# EAGLE schematic UNDP_Sensor (EAGLE 9.6.2)
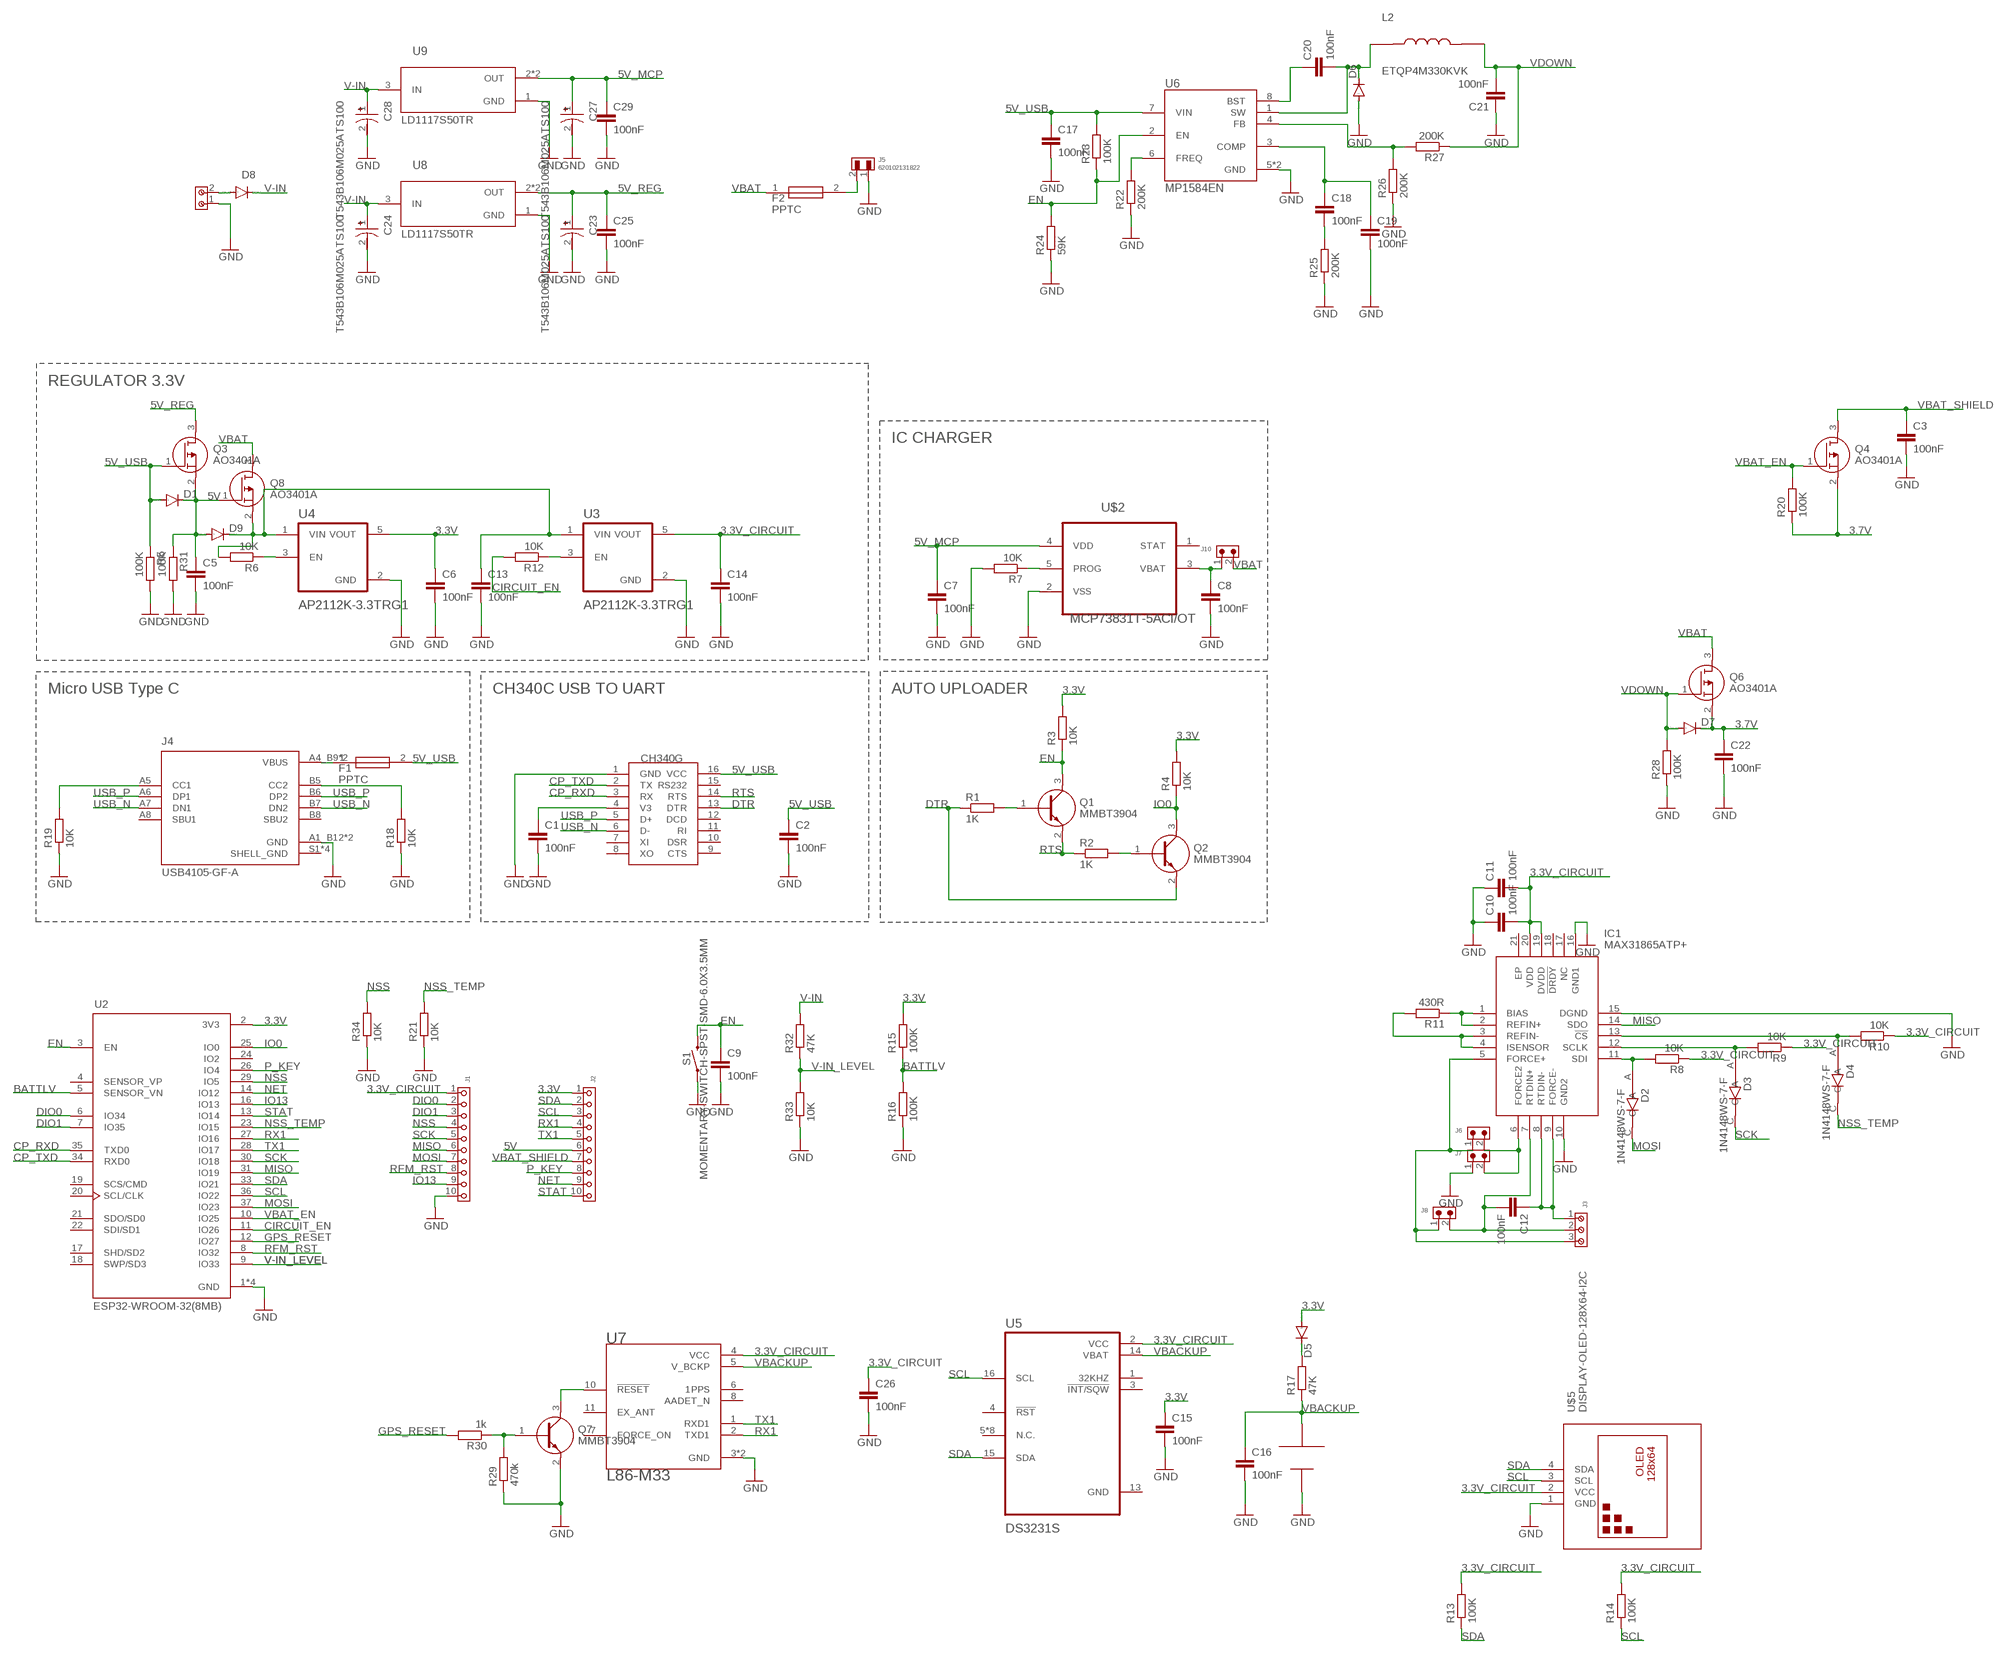
[diagram p0: schematic, sheet 1]

## Parts
C1  100nF  C-EUC0603  [C0603]
C2  100nF  C-EUC0603  [C0603]
C3  100nF  C-EUC0603  [C0603]
C5  100nF  C-EUC0603  [C0603]
C6  100nF  C-EUC0603  [C0603]
C7  100nF  C-EUC0603  [C0603]
C8  100nF  C-EUC0603  [C0603]
C9  100nF  C-EUC0603  [C0603]
C10  100nF  C-EUC0603  [C0603]
C11  100nF  C-EUC0603  [C0603]
C12  100nF  C-EUC0603  [C0603]
C13  100nF  C-EUC0603  [C0603]
C14  100nF  C-EUC0603  [C0603]
C15  100nF  C-EUC0603  [C0603]
C16  100nF  C-EUC0603  [C0603]
C17  100nF  C-EUC0603  [C0603]
C18  100nF  C-EUC0603  [C0603]
C19  100nF  C-EUC0603  [C0603]
C20  100nF  C-EUC0603  [C0603]
C21  100nF  C-EUC0603  [C0603]
C22  100nF  C-EUC0603  [C0603]
C23  T543B106M025ATS100  [CAPPM3528X210N]
C24  T543B106M025ATS100  [CAPPM3528X210N]
C25  100nF  C-EUC0603  [C0603]
C26  100nF  C-EUC0603  [C0603]
C27  T543B106M025ATS100  [CAPPM3528X210N]
C28  T543B106M025ATS100  [CAPPM3528X210N]
C29  100nF  C-EUC0603  [C0603]
D1  DIODE-DO214AC  [DO214AC]
D2  1N4148WS-7-F  [SOD2513X120N]
D3  1N4148WS-7-F  [SOD2513X120N]
D4  1N4148WS-7-F  [SOD2513X120N]
D5  DIODE-DO214AC  [DO214AC]
D6  DIODE-DO214AC  [DO214AC]
D7  DIODE-DO214AC  [DO214AC]
D8  DIODE-DO214AC  [DO214AC]
D9  DIODE-DO214AC  [DO214AC]
F1  PPTC  MF-NSML260_12-2  [FUSC3216X100N]
F2  PPTC  MF-NSML260_12-2  [FUSC3216X100N]
IC1  MAX31865ATP+  [QFN65P500X500X80-21N]
J1  6200XX11821_62001011821  [62001011821]
J2  6200XX11821_62001011821  [62001011821]
J3  691134710003  [691134710003]
J4  USB4105-GF-A  [GCT_USB4105-GF-A]
J5  620102131822  [620102131822]
J6  6130XX11121_61300211121  [61300211121]
J7  6130XX11121_61300211121  [61300211121]
J8  6130XX11121_61300211121  [61300211121]
J10  6130XX11121_61300211121  [61300211121]
J11  691134710002  [691134710002]
L2  ETQP4M330KVK  [IND_ETQP4M330KVK]
Q1  MMBT3904  [SOT95P240X120-3N]
Q2  MMBT3904  [SOT95P240X120-3N]
Q3  AO3401A  [SOT95P280X125-3N]
Q4  AO3401A  [SOT95P280X125-3N]
Q6  AO3401A  [SOT95P280X125-3N]
Q7  MMBT3904  [SOT95P240X120-3N]
Q8  AO3401A  [SOT95P280X125-3N]
R1  1K  R-EU_R0603  [R0603]
R2  1K  R-EU_R0603  [R0603]
R3  10K  R-EU_R0603  [R0603]
R4  10K  R-EU_R0603  [R0603]
R5  100K  R-EU_R0603  [R0603]
R6  10K  R-EU_R0603  [R0603]
R7  10K  R-EU_R0603  [R0603]
R8  10K  R-EU_R0603  [R0603]
R9  10K  R-EU_R0603  [R0603]
R10  10K  R-EU_R0603  [R0603]
R11  430R  R-EU_R0603  [R0603]
R12  10K  R-EU_R0603  [R0603]
R13  100K  R-EU_R0603  [R0603]
R14  100K  R-EU_R0603  [R0603]
R15  100K  R-EU_R0603  [R0603]
R16  100K  R-EU_R0603  [R0603]
R17  47K  R-EU_R0603  [R0603]
R18  10K  R-EU_R0603  [R0603]
R19  10K  R-EU_R0603  [R0603]
R20  100K  R-EU_R0603  [R0603]
R21  10K  R-EU_R0603  [R0603]
R22  200K  R-EU_R0603  [R0603]
R23  100K  R-EU_R0603  [R0603]
R24  59K  R-EU_R0603  [R0603]
R25  200K  R-EU_R0603  [R0603]
R26  200K  R-EU_R0603  [R0603]
R27  200K  R-EU_R0603  [R0603]
R28  100K  R-EU_R0603  [R0603]
R29  470k  R-EU_R0603  [R0603]
R30  1k  R-EU_R0603  [R0603]
R31  100K  R-EU_R0603  [R0603]
R32  47K  R-EU_R0603  [R0603]
R33  10K  R-EU_R0603  [R0603]
R34  10K  R-EU_R0603  [R0603]
S1  MOMENTARY-SWITCH-SPST-SMD-6.0X3.5MM  [TACTILE_SWITCH_SMD_6.0X3.5MM]
U2  ESP32-WROOM-32(8MB)  [MODULE_ESP32-WROOM-32(8MB)]
U3  AP2112K-3.3TRG1  [SOT95P285X140-5N]
U4  AP2112K-3.3TRG1  [SOT95P285X140-5N]
U5  DS3231S  [SOIC127P1032X265-16N]
U6  MP1584EN  [SOIC127P600X170-9N]
U7  L86-M33  [XCVR_L86-M33]
U8  LD1117S50TR  [SOT230P700X180-4N]
U9  LD1117S50TR  [SOT230P700X180-4N]
U$1  CH340G-3D  [SOIC127P600X175-16N]
U$2  MCP73831T-5ACI/OT  [SOT95P280X145-5N]
U$4  MS621FE  [MS621FE]
U$5  DISPLAY-OLED-128X64-I2C  [DISPLAY-OLED-128X64-I2C]

## Nets
3.3V: C6.1 C15.1 D5.A J2.1 R3.2 R4.2 R15.2 U2.2(3V3) U4.5(VOUT)
3.3V_CIRCUIT: C10.2 C11.2 C14.1 C26.1 IC1.19(DVDD) IC1.20(VDD) J1.1 R8.1 R9.1 R10.1 R13.2 R14.2 U3.5(VOUT) U5.2(VCC) U7.4(VCC) U$5.2(VCC)
3.7V: C22.1 D7.C Q4.2(S) Q6.2(S) R20.1
5V: C5.1 D1.C D9.A J2.6 Q3.2(S) Q8.1(G) R31.1
5V_MCP: C7.1 C27.1 C29.1 U9.2(OUT) U9.4(OUT) U$2.4(VDD)
5V_REG: C23.1 C25.1 Q3.3(D) U8.2(OUT) U8.4(OUT)
5V_USB: C2.1 C17.1 D1.A F1.2 Q3.1(G) R5.1 R23.2 U6.7(VIN) U$1.16(VCC)
BATTLV: R15.1 R16.2 U2.5(SENSOR_VN)
CIRCUIT_EN: R12.2 U2.11(IO26)
CP_RXD: U2.35(TXD0) U$1.3(RX)
CP_TXD: U2.34(RXD0) U$1.2(TX)
DIO0: J1.2 U2.6(IO34)
DIO1: J1.3 U2.7(IO35)
DTR: Q2.2(E) R1.1 U$1.13(DTR)
EN: C9.1 Q1.3(C) R3.1 R23.1 R24.2 S1.2 U2.3(EN) U6.2(EN)
GND: C1.2 C2.2 C3.2 C5.2 C6.2 C7.2 C8.2 C9.2 C10.1 C11.1 C13.2 C14.2 C15.2 C16.2 C17.2 C19.2 C21.1 C22.2 C23.2 C24.2 C25.2 C26.2 C27.2 C28.2 C29.2 D6.A IC1.10(GND2) IC1.15(DGND) IC1.16(GND1) J1.10 J4.A1_B12(GND) J4.B1_A12(GND) J5.1 J7.1 J11.1 Q7.2(E) R5.2 R7.2 R16.1 R18.1 R19.1 R21.1 R22.1 R24.1 R25.1 R26.1 R28.1 R29.1 R31.2 R33.1 R34.1 S1.1 U2.1(GND) U2.15(GND) U2.38(GND) U2.39(GND) U3.2(GND) U4.2(GND) U6.5(GND) U6.9(GND) U7.3(GND) U7.12(GND) U8.1(GND) U9.1(GND) U$1.1(GND) U$2.2(VSS) U$4.V- U$5.1(GND)
GPS_RESET: R30.2 U2.12(IO27)
IO0: Q2.3(C) R4.1 U2.25(IO0)
IO13: J1.9 U2.16(IO13)
MISO: IC1.14(SDO) J1.6 U2.31(IO19)
MOSI: D2.C J1.7 U2.37(IO23)
N$1: F1.1 J4.A4_B9(VBUS) J4.B4_A9(VBUS)
N$2: C1.1 U$1.4(V3)
N$3: R6.1 U4.3(EN)
N$4: Q1.1(B) R1.2
N$5: R7.1 U$2.5(PROG)
N$6: C13.1 D9.C Q8.2(S) R6.2 U3.1(VIN) U4.1(VIN)
N$7: Q2.1(B) R2.2
N$8: D2.A IC1.11(SDI) R8.2
N$9: D3.A IC1.12(SCLK) R9.2
N$10: D4.A IC1.13(!CS) R10.2
N$11: IC1.6(FORCE2) J6.2 J7.2
N$12: IC1.1(BIAS) IC1.2(REFIN+) R11.1
N$13: IC1.3(REFIN-) IC1.4(ISENSOR) R11.2
N$14: IC1.5(FORCE+) J3.3 J6.1 J8.1
N$15: C12.2 IC1.7(RTDIN+) J3.2 J8.2
N$16: C12.1 IC1.8(RTDIN-) IC1.9(FORCE-) J3.1
N$17: R12.1 U3.3(EN)
N$18: D5.C R17.2
N$19: J4.A5(CC1) R19.2
N$20: F2.2 J5.2
N$22: R22.2 U6.6(FREQ)
N$23: C20.2 D6.C L2.1 U6.1(SW)
N$24: C18.1 C19.1 U6.3(COMP)
N$25: J4.B5(CC2) R18.2
N$26: C18.2 R25.2
N$27: D8.A J11.2
N$28: R26.2 R27.2 U6.4(FB)
N$29: C20.1 U6.8(BST)
N$31: C8.1 J10.1 U$2.3(VBAT)
N$33: Q7.3(C) U7.10(!RESET)
N$34: Q7.1(B) R29.2 R30.1
NET: J2.9 U2.14(IO12)
NSS: J1.4 R34.2 U2.29(IO5)
NSS_TEMP: D4.C R21.2 U2.23(IO15)
P_KEY: J2.8 U2.26(IO4)
RFM_RST: J1.8 U2.8(IO32)
RTS: Q1.2(E) R2.1 U$1.14(RTS)
RX1: J2.4 U2.27(IO16) U7.2(TXD1)
SCK: D3.C J1.5 U2.30(IO18)
SCL: J2.3 R14.1 U2.36(IO22) U5.16(SCL) U$5.3(SCL)
SDA: J2.2 R13.1 U2.33(IO21) U5.15(SDA) U$5.4(SDA)
STAT: J2.10 U2.13(IO14)
TX1: J2.5 U2.28(IO17) U7.1(RXD1)
USB_N: J4.A7(DN1) J4.B7(DN2) U$1.6(D-)
USB_P: J4.A6(DP1) J4.B6(DP2) U$1.5(D+)
V-IN: C24.1 C28.1 D8.C R32.2 U8.3(IN) U9.3(IN)
V-IN_LEVEL: R32.1 R33.2 U2.9(IO33)
VBACKUP: C16.1 R17.1 U5.14(VBAT) U7.5(V_BCKP) U$4.V+
VBAT: F2.1 J10.2 Q6.3(D) Q8.3(D)
VBAT_EN: Q4.1(G) R20.2 U2.10(IO25)
VBAT_SHIELD: C3.1 J2.7 Q4.3(D)
VDOWN: C21.2 D7.A L2.2 Q6.1(G) R27.1 R28.2
Unconnected: IC1.17(NC) IC1.18(!DRDY) IC1.21(EP) J4.A8(SBU1) J4.B8(SBU2) U2.4(SENSOR_VP) U2.17(SHD/SD2) U2.18(SWP/SD3) U2.19(SCS/CMD) U2.20(SCL/CLK) U2.21(SDO/SD0) U2.22(SDI/SD1) U2.24(IO2) U5.1(32KHZ) U5.3(!INT/SQW) U5.4(!RST) U5.5(N.C.) U5.6(N.C.) U5.7(N.C.) U5.8(N.C.) U5.9(N.C.) U5.10(N.C.) U5.11(N.C.) U5.12(N.C.) U7.6(1PPS) U7.7(FORCE_ON) U7.8(AADET_N) U7.11(EX_ANT) U$1.7(XI) U$1.8(XO) U$1.9(CTS) U$1.10(DSR) U$1.11(RI) U$1.12(DCD) U$1.15(RS232) U$2.1(STAT)

## Notes on the sheet
- REGULATOR 3.3V
- IC CHARGER
- Micro USB Type C | CH340C USB TO UART | AUTO UPLOADER

## Power pins joined to a net without a drawn wire
GND: U5.13(GND)
SHELL_GND: J4.S1(SHELL_GND) J4.S2(SHELL_GND) J4.S3(SHELL_GND) J4.S4(SHELL_GND)

## Library data of the parts
C1-C3 C5-C22 C25 C26 C29 = rcl:C-EU: CAPACITOR, European symbol; SPICEPREFIX: C
C23 C24 C27 C28 = T543B106M025ATS100:T543B106M025ATS100: Check prices <https://pricing.snapeda.com/parts/T543B106M025ATS100/KEMET/view-part?ref=eda>; AVAILABILITY: Not in stock; DESCRIPTION: CAP TANT POLY 10UF 25V 3528; MF: KEMET; MP: T543B106M025ATS100; PACKAGE: 1411 KEMET; PRICE: None
D1 D5-D9 = diode:DIODE-: DIODE
D2-D4 = 1N4148WS-7-F:1N4148WS-7-F: 1N4148WS Series 2 A 75 V 200 mW Surface Mount Fast Switching Diode - SOD-323 Check prices <https://pricing.snapeda.com/parts/1N4148WS-7-F/Diodes%20Inc./view-part?ref=eda>; AVAILABILITY: In Stock; DESCRIPTION: Diode Standard 75V 150mA Surface Mount SOD-323; MF: Diodes Inc.; MP: 1N4148WS-7-F; PACKAGE: SOD-323 Diodes Inc.; PRICE: None; PURCHASE-URL: https://pricing.snapeda.com/search/part/1N4148WS-7-F/?ref=eda
F1 F2 = MF-NSML260_12-2:MF-NSML260_12-2: Resettable Fuses - PPTC 2.6A 12V 1206 LOW-OHMIC Source: Datasheet <https://www.bourns.com/docs/product-datasheets/mf-nsml-x.pdf>; ARROW_PART_NUMBER: MF-NSML260/12-2; ARROW_PRICE-STOCK: https://www.arrow.com/en/products/mf-nsml26012-2/bourns; DESCRIPTION: Resettable Fuses - PPTC 2.6A 12V 1206 LOW-OHMIC; HEIGHT: 1mm; MANUFACTURER_NAME: Bourns; MANUFACTURER_PART_NUMBER: MF-NSML260/12-2; MOUSER_PART_NUMBER: 652-MF-NSML260/12-2; MOUSER_PRICE-STOCK: https://www.mouser.com/Search/Refine.aspx?Keyword=652-MF-NSML260%2F12-2
IC1 = MAX31865ATP+:MAX31865ATP+: RTD-to-Digital Converter SPI TQFN20 MAX31865ATP+, 15 bit RTD to Digital Converter 0.05% SPI 3 3.6 V 20-Pin TQFN-EP Source: Datasheet <http://docs-emea.rs-online.com/webdocs/13b7/0900766b813b73b4.pdf>; DESCRIPTION: RTD-to-Digital Converter SPI TQFN20 MAX31865ATP+, 15 bit RTD to Digital Converter 0.05% SPI 3 3.6 V 20-Pin TQFN-EP; HEIGHT: 0.8mm; MANUFACTURER_NAME: Maxim Integrated; MANUFACTURER_PART_NUMBER: MAX31865ATP+; MOUSER_PART_NUMBER: 700-MAX31865ATP+; MOUSER_PRICE-STOCK: https://www.mouser.co.uk/ProductDetail/Maxim-Integrated/MAX31865ATP%2b?qs=mIV%2FTjyUFhk4bxPuxGz9eQ%3D%3D
J1 J2 = Wurth_Connectors_WR-PHD:6200XX11821_62001011821: WR-PHD 2.00 mm Socket Header ARTICLE PROPERTIES: Pins:2;​ 4;​ 6;​ 8;​ 10;​ 20;​ 32 KIND PROPERTIES: Pitch：2 mm Quality Class:3 as per CECC 75 301-802 Rows：Single Gender：Socket Header Type：Straight;​ Angled MATERIAL PROPERTIES: Insulator Material :PA9T Insulator Flammability Rating:UL94 V-0 Contact Material:Copper Alloy Contact Plating:Gold Contact Type:Stamped GENERAL INFORMATION Operating Temperature:-40 up to +105 °C Compliance:Lead free / RoHS ELECTRICAL PROPERTIES: Rated Current:2A;max. IR 1:2A Withstanding Voltage:500 V (AC) Contact Resistance:20 mΩ RISO:1000 MΩ CERTIFICATION UL Approval:E323964 PACKAGING PROPERTIES Packaging:Tube Packaging Unit:128;​ 67;​ 46;​ 35;​ 28;​ 14;​ 9 <https://katalog.we-online.com/media/images/v2/o33220v209%20Family_WR-PHD_6200xx11821.jpg> Details see: https://katalog.we-online.com/en/em/PHD_2_00_SOCKET_HEADER_6200XX11821 Updated by Yingchun,Shan 2019-10-24 2019 (C) Würth Elektronik; DATASHEET-URL: https://katalog.we-online.com/em/datasheet/62001011821.pdf; GENDER: Socket Header; IR: 2A; MATES: WR-PHD 2.0mm THT Pin Header; PACKAGING: Tube; PART-NUMBER: 62001011821; PINS: 10; ROWS: Single; TYPE: Straight
J3 = Wurth_Connectors_WR-TBL Wire Protector:691134710003: WR-TBL Serie 1347- 5.00 mm Horizontal Cable Entry w. Pressure Clamp KIND PROPERTIES Pitch 5 mm MATERIAL PROPERTIES Insulator Material PC Insulator Flammability Rating UL94 V-0 Insulator Color Grey Contact Material Copper Alloy Contact Plating Nickel over Tin Contact Type Stamped Terminal Screw Material Steel Terminal Screw Plating Zinc Wire Guard Material Copper Alloy GENERAL INFORMATION Operating Temperature -30 up to +120 °C Compliance Lead free / RoHS ELECTRICAL PROPERTIES IR UL 16 A IR VDE 24 A Working Voltage [UL] 300 V (AC) Working Voltage [VDE] 450 V (AC) Withstanding Voltage [UL] 1600 V (AC) Withstanding Voltage [cULus] 2000 V (AC) Withstanding Voltage [VDE] 2500 V (AC) Contact Resistance 20 mΩ Contact Resistance [UL] 20 mΩ Contact Resistance [VDE] 20 mΩ MECHANICAL PROPERTIES Wire Strip Length 7 (mm) Screw M3 Solid Wire Section (AWG) 30 to 14 (AWG) Solid Wire Section (Metric) 0.05 to 2.08 (mm²) Stranded Wire Section (AWG) 30 to 14 (AWG) Stranded Wire Section (Metric) 0.05 to 2.08 (mm²) CERTIFICATION UL Approval E150931 CAT N: CMM (1) VDE Approval 40021362 VDE Approval 40021375 TYPE: CMM PACKAGING PROPERTIES Packaging Box <https://katalog.we-online.com/media/images/v2/o32799v209%20Family_WR-TBL1_Series1347.jpg> Details see: https://katalog.we-online.com/en/em/TBL_5_00_1347_HORIZONTAL_ENTRY_W_PRESSURE_CLAMP_69113471000x Updated by Ella Wu 2019-11-08 2019(C) Wurth Elektronik; DATASHEET-URL: https://www.we-online.com/catalog/datasheet/691134710003.pdf; IR-UL: 16A; IR-VDE: 24A; MOUNT: THT; PART-NUMBER: 691134710003; PINS: 3; PITCH: 5mm; TYPE: Horizontal; WIRE: 30 to 14 (AWG) 0.05 to 2.08 (mm²); WORKING-VOLTAGE-UL: 300V(AC); WORKING-VOLTAGE-VDE: 450V(AC)
J4 = USB4105-GF-A:USB4105-GF-A: USB-C (USB TYPE-C) USB 2.0 Receptacle Connector 24 (16+8 Dummy) Position Surface Mount, Right Angle; Through Hole Check prices <https://pricing.snapeda.com/parts/USB4105-GF-A/GCT/view-part?ref=eda>; AVAILABILITY: In Stock; DESCRIPTION: USB-C (USB TYPE-C) USB 2.0 Receptacle Connector 24 (16+8 Dummy) Position Surface Mount, Right Angle; Through Hole; MF: GCT; MP: USB4105-GF-A; PACKAGE: None; PRICE: None; PURCHASE-URL: https://pricing.snapeda.com/search/part/USB4105-GF-A/?ref=eda
J5 = Wurth_Connectors_WR-WTB:620102131822: WR-WTB 2.00 mm SMT Male Horizontal Shrouded Header KIND PROPERTIES: Pitch:2 mm Gender:Male MATERIAL PROPERTIES: Insulator Material :PA9T Insulator Flammability Rating:UL94 V-0 Color:Beige Contact Material:Copper Alloy Contact Plating:Tin Contact Type:Stamped GENERAL INFORMATION Operating Temperature:-25 up to +85 °C Compliance: RoHS Working Voltage:100 V (AC) Withstanding Voltage:800V (AC) Contact Resistance:20 mΩ RISO:1000 MΩ CERTIFICATION UL Approval:E323964 PACKAGING PROPERTIES Packaging:Tape and Reel <https://katalog.we-online.com/media/images/v2/o33353v209%20Family_WR-WTB_6201xx131822.jpg> Details see: https://katalog.we-online.com/en/em/WTB_2_00_SMT_MALE_HORIZONTAL_SHROUDED_HEADER_6201XX131822 Updated by Yingchun,Shan 2019-11-08 2019 (C) Würth Elektronik; CONTACT-RESISTANCE: 20mOhm; DATASHEET-URL: https://www.we-online.com/catalog/datasheet/620102131822.pdf; GENDER: Male; IR: 2A; L: 8mm; MOUNT: SMT; PACKAGING: Tape and Reel; PART-NUMBER: 620102131822; PCB-CABLE-PANEL: PCB; PINS: 2; PITCH: 2mm; TOL-R: max.; TYPE: Horizontal; USE-WITH: WR-WTB 2.00 mm Female Terminal Housing; WORKING-VOLTAGE: 100V(AC)
J6-J8 J10 = Wurth_Connectors_WR-PHD:6130XX11121_61300211121: WR-PHD 2.54 mm THT Pin Header ARTICLE PROPERTIES: Pins:1;​ 2;​ 3;​ 4;​ 5;​ 6;​ 7;​ 8;​ 9;​ 10;​ 12;​ 13;​ 14;​ 15;​ 16;​ 18;​ 20;​ 22;​ 24;​ 25;​ 32;​ 36;​ 40 KIND PROPERTIES: Pitch：2.54 mm Quality Class:3 as per CECC 75 301-802 Rows：Single Gender：Pin Header Type：Straight MATERIAL PROPERTIES: Insulator Material :PBT Insulator Flammability Rating:UL94 V-0 Contact Material:Copper Alloy Contact Plating:Gold Contact Type:Stamped GENERAL INFORMATION Operating Temperature:-40 up to +105 °C Compliance:RoHS ELECTRICAL PROPERTIES: Rated Current:3 A IR 1:3 A Withstanding Voltage:500 V (AC) Contact Resistance:20 mΩ RISO:1000 MΩ CERTIFICATION UL Approval:E323964 PACKAGING PROPERTIES Packaging:Bag <https://katalog.we-online.com/media/images/v2/o33211v209%20Family_BTB_PHD_6130xx11121.jpg> Details see: https://katalog.we-online.com/en/em/PHD_2_54_THT_PIN_HEADER_6130XX11121 Updated by Yingchun,Shan 2019-10-16 2019 (C) Würth Elektronik; DATASHEET-URL: https://katalog.we-online.com/em/datasheet/61300211121.pdf; GENDER: Pin Header; IR: 3A; MATES: WR-PHD 2.54mm Angled Socket Header /SMT Socket Header/Socket Header; PACKAGING: Bag; PART-NUMBER: 61300211121; PINS: 2; ROWS: Single; TYPE: Straight
J11 = Wurth_Connectors_WR-TBL Wire Protector:691134710002: WR-TBL Serie 1347- 5.00 mm Horizontal Cable Entry w. Pressure Clamp KIND PROPERTIES Pitch 5 mm MATERIAL PROPERTIES Insulator Material PC Insulator Flammability Rating UL94 V-0 Insulator Color Grey Contact Material Copper Alloy Contact Plating Nickel over Tin Contact Type Stamped Terminal Screw Material Steel Terminal Screw Plating Zinc Wire Guard Material Copper Alloy GENERAL INFORMATION Operating Temperature -30 up to +120 °C Compliance Lead free / RoHS ELECTRICAL PROPERTIES IR UL 16 A IR VDE 24 A Working Voltage [UL] 300 V (AC) Working Voltage [VDE] 450 V (AC) Withstanding Voltage [UL] 1600 V (AC) Withstanding Voltage [cULus] 2000 V (AC) Withstanding Voltage [VDE] 2500 V (AC) Contact Resistance 20 mΩ Contact Resistance [UL] 20 mΩ Contact Resistance [VDE] 20 mΩ MECHANICAL PROPERTIES Wire Strip Length 7 (mm) Screw M3 Solid Wire Section (AWG) 30 to 14 (AWG) Solid Wire Section (Metric) 0.05 to 2.08 (mm²) Stranded Wire Section (AWG) 30 to 14 (AWG) Stranded Wire Section (Metric) 0.05 to 2.08 (mm²) CERTIFICATION UL Approval E150931 CAT N: CMM (1) VDE Approval 40021362 VDE Approval 40021375 TYPE: CMM PACKAGING PROPERTIES Packaging Box <https://katalog.we-online.com/media/images/v2/o32799v209%20Family_WR-TBL1_Series1347.jpg> Details see: https://katalog.we-online.com/en/em/TBL_5_00_1347_HORIZONTAL_ENTRY_W_PRESSURE_CLAMP_69113471000x Updated by Ella Wu 2019-11-08 2019(C) Wurth Elektronik; DATASHEET-URL: https://www.we-online.com/catalog/datasheet/691134710002.pdf; IR-UL: 16A; IR-VDE: 24A; MOUNT: THT; PART-NUMBER: 691134710002; PINS: 2; PITCH: 5mm; TYPE: Horizontal; WIRE: 30 to 14 (AWG) 0.05 to 2.08 (mm²); WORKING-VOLTAGE-UL: 300V(AC); WORKING-VOLTAGE-VDE: 450V(AC)
L2 = ETQP4M330KVK:ETQP4M330KVK: Check prices <https://pricing.snapeda.com/parts/ETQP4M330KVK/Panasonic/view-part?ref=eda>; AVAILABILITY: In Stock; DESCRIPTION: Ind Power Shielded 33uH 20% 100KHz Metal 3.1A 8.5 X 8 X 3.95 T/R; MF: Panasonic; MP: ETQP4M330KVK; PACKAGE: SMD-2 Panasonic; PRICE: None; PURCHASE-URL: https://pricing.snapeda.com/search/part/ETQP4M330KVK/?ref=eda
Q1 Q2 Q7 = MMBT3904:MMBT3904: Transistor GP BJT NPN 40V 0.2A SOT23 Fairchild MMBT3904 NPN Bipolar Transistor, 0.2 A, 40 V, 3-Pin SOT-23 Source: Datasheet <https://media.digikey.com/pdf/Data Sheets/ON Semiconductor PDFs/2N3904,MMBT3904,PZT3904.pdf>; ARROW_PART_NUMBER: MMBT3904; ARROW_PRICE-STOCK: https://www.arrow.com/en/products/mmbt3904/on-semiconductor; DESCRIPTION: Transistor GP BJT NPN 40V 0.2A SOT23 Fairchild MMBT3904 NPN Bipolar Transistor, 0.2 A, 40 V, 3-Pin SOT-23; HEIGHT: 1.2mm; MANUFACTURER_NAME: ON Semiconductor; MANUFACTURER_PART_NUMBER: MMBT3904; MOUSER_PART_NUMBER: 512-MMBT3904; MOUSER_PRICE-STOCK: https://www.mouser.co.uk/ProductDetail/ON-Semiconductor-Fairchild/MMBT3904?qs=UMEuL5FsraCg3xKjS4uBJQ%3D%3D
Q3 Q4 Q6 Q8 = AO3401A:AO3401A: 30V P-Channel MOSFET Source: Datasheet <http://www.aosmd.com/pdfs/datasheet/AO3401A.pdf>; ARROW_PART_NUMBER: AO3401A; ARROW_PRICE-STOCK: https://www.arrow.com/en/products/ao3401a/alpha-and-omega-semiconductor; DESCRIPTION: 30V P-Channel MOSFET; HEIGHT: 1.25mm; MANUFACTURER_NAME: Alpha & Omega Semiconductors; MANUFACTURER_PART_NUMBER: AO3401A
R1-R34 = rcl:R-EU_: RESISTOR, European symbol; SPICEPREFIX: R
S1 = SparkFun-Switches:MOMENTARY-SWITCH-SPST: Momentary Switch (Pushbutton) - SPST Normally-open (NO) SPST momentary switches (buttons, pushbuttons). Variants PTH-12MM - 12mm square, through-hole Momentary Pushbutton Switch - 12mm Square <https://www.sparkfun.com/products/9190> (COM-09190) PTH-6.0MM, PTH-6.0MM-KIT - 6.0mm square, through-hole Mini Pushbutton Switch <https://www.sparkfun.com/products/97> (COM-00097) KIT package intended for soldering kit's - only one side of pads' copper is exposed. PTH-RIGHT-ANGLE-KIT - Right-angle, through-hole Right Angle Tactile Button <https://www.sparkfun.com/products/10791> - Used on SparkFun BigTime Watch Kit <https://www.sparkfun.com/products/11734> SMD-12MM - 12mm square, surface-mount Tactile Button - SMD (12mm) <https://www.sparkfun.com/products/12993> (COM-12993) Used on SparkFun PicoBoard <https://www.sparkfun.com/products/11888> SMD-4.5MM - 4.5mm Square Trackball Switch Used on SparkFun Blackberry Trackballer Breakout <https://www.sparkfun.com/products/13169> SMD-4.6MMX2.8MM - 4.60mm x 2.80mm, surface mount Used on SparkFun SAMD21 Mini Breakout <https://www.sparkfun.com/products/13664> SMD-5.2MM, SMD-5.2-REDUNDANT - 5.2mm square, surface-mount Mini Pushbutton Switch - SMD <https://www.sparkfun.com/products/8720> (COM-08720) Used on Arduino Pro Mini <https://www.sparkfun.com/products/11114> REDUNDANT package connects both switch circuits together SMD-6.0X3.5MM - 6.0 x 3.5mm, surface mount Momentary Reset Switch SMD <https://www.sparkfun.com/products/8229> (COM-08229) SMD-6.2MM-TALL - 6.2mm square, surface mount Tactile Button - SMD (6mm) <https://www.sparkfun.com/products/12992> Used on SparkFun Digital Sandbox <https://www.sparkfun.com/products/12651> SMD-RIGHT-ANGLE - Right-angle, surface mount Used on SparkFun Block for Intel® Edison - Arduino <https://www.sparkfun.com/products/13036>; PROD_ID: SWCH-00815; SF_SKU: COM-08229
U2 = ESP32-WROOM-32_8MB_:ESP32-WROOM-32(8MB): WIFI MODULE 64 MBITS SPI FLASH; AVAILABILITY: Unavailable; DESCRIPTION: Bluetooth, WiFi 802.11b/g/n, Bluetooth v4.2 +EDR, Class 1, 2 and 3 Transceiver Module 2.4GHz ~ 2.5GHz Surface Mount; MF: Espressif Systems; MP: ESP32-WROOM-32 (8MB); PACKAGE: Module Espressif Systems; PRICE: None
U3 U4 = AP2112K-3.3TRG1:AP2112K-3.3TRG1: AP2112 Series 0.6 A 3.3 V Fixed Output SMT LDO Linear Regulator - SOT23-5; AVAILABILITY: Unavailable; DESCRIPTION: Linear Voltage Regulator IC 1 Output 600mA SOT-25; MF: Diodes Inc.; MP: AP2112K-3.3TRG1; PACKAGE: SOT-753 Diodes Inc.; PRICE: None
U5 = DS3231S:DS3231S: Check prices <https://pricing.snapeda.com/parts/DS3231S/Maxim%20Integrated/view-part?ref=eda>; AVAILABILITY: Warning; DESCRIPTION: Real Time Clock (RTC) IC Clock/Calendar I²C, 2-Wire Serial 16-SOIC (0.295, 7.50mm Width); MF: Maxim Integrated; MP: DS3231S; PACKAGE: SOIC-16 Maxim Integrated; PRICE: None; PURCHASE-URL: https://pricing.snapeda.com/search/part/DS3231S/?ref=eda
U6 = MP1584EN:MP1584EN: 3A, 1.5MHz, 28V Step-Down Converter Check prices <https://pricing.snapeda.com/parts/MP1584EN/Monolithic%20Power/view-part?ref=eda>; AVAILABILITY: In Stock; DESCRIPTION: Buck Switching Regulator IC Positive Adjustable 0.8V 1 Output 3A 8-SOIC (0.154, 3.90mm Width) Exposed Pad; MF: Monolithic Power; MP: MP1584EN; PACKAGE: SOIC-8 Monolithic Power; PRICE: None; PURCHASE-URL: https://pricing.snapeda.com/search/part/MP1584EN/?ref=eda
U7 = L86-M33:L86-M33: L86 is an ultra-compact GNSS POT (Patch on Top) module with an embedded 18.4mm × 18.4mm × 4.0mm patch antenna and utilizes the MediaTek new generation GNSS chipset MT3333 that achieves the perfect performance Check prices <https://pricing.snapeda.com/parts/L86-M33/Quectel/view-part?ref=eda>; AVAILABILITY: In Stock; DESCRIPTION: L86 is an ultra-compact GNSS POT (Patch on Top) module with an embedded 18.4mm × 18.4mm × 4.0mm patch antenna and utilizes the MediaTek new generation GNSS chipset MT3333 that achieves the perfect performance; MF: Quectel; MP: L86-M33; PACKAGE: LCC-12 Quectel; PRICE: None; PURCHASE-URL: https://pricing.snapeda.com/search/part/L86-M33/?ref=eda
U8 U9 = LD1117S50TR:LD1117S50TR: LDO Voltage Regulators 3.3V 0.8A Positive Check prices <https://pricing.snapeda.com/parts/LD1117S50TR/STMicroelectronics/view-part?ref=eda>; AVAILABILITY: Good; DESCRIPTION: Linear Voltage Regulator IC 1 Output 800mA SOT-223; MF: STMicroelectronics; MP: LD1117S50TR; PACKAGE: SOT-223 STMicroelectronics; PRICE: None; PURCHASE-URL: https://pricing.snapeda.com/search/part/LD1117S50TR/?ref=eda
U$1 = ch340g:CH340G-3D
U$2 = MCP73831T-5ACI_OT:MCP73831T-5ACI/OT: Charge Management Controller Check prices <https://pricing.snapeda.com/parts/MCP73831T-5ACI/OT/Microchip/view-part?ref=eda>; AVAILABILITY: Good; DESCRIPTION: Charger IC Lithium Ion/Polymer SOT-23-5; MF: Microchip; MP: MCP73831T-5ACI/OT; PACKAGE: SOT-23-5 Microchip; PRICE: None; PURCHASE-URL: https://pricing.snapeda.com/search/part/MCP73831T-5ACI/OT/?ref=eda
U$4 = MS621FE:MS621FE
U$5 = diy-modules:DISPLAY-OLED-128X64-I2C: 128x64 Dot Matrix OLED Module based on SSD1306 chip Variant with I2C interface More details available here: http://www.instructables.com/id/Monochrome-096-i2c-OLED-display-with-arduino-SSD13/ SSD1306 datasheet: https://cdn-shop.adafruit.com/datasheets/SSD1306.pdf Click here to find device on ebay.com <http://www.ebay.com/sch/oled+display+128x64+iic> Note: There are two variants: I2C and SPI. Search for the proper version.